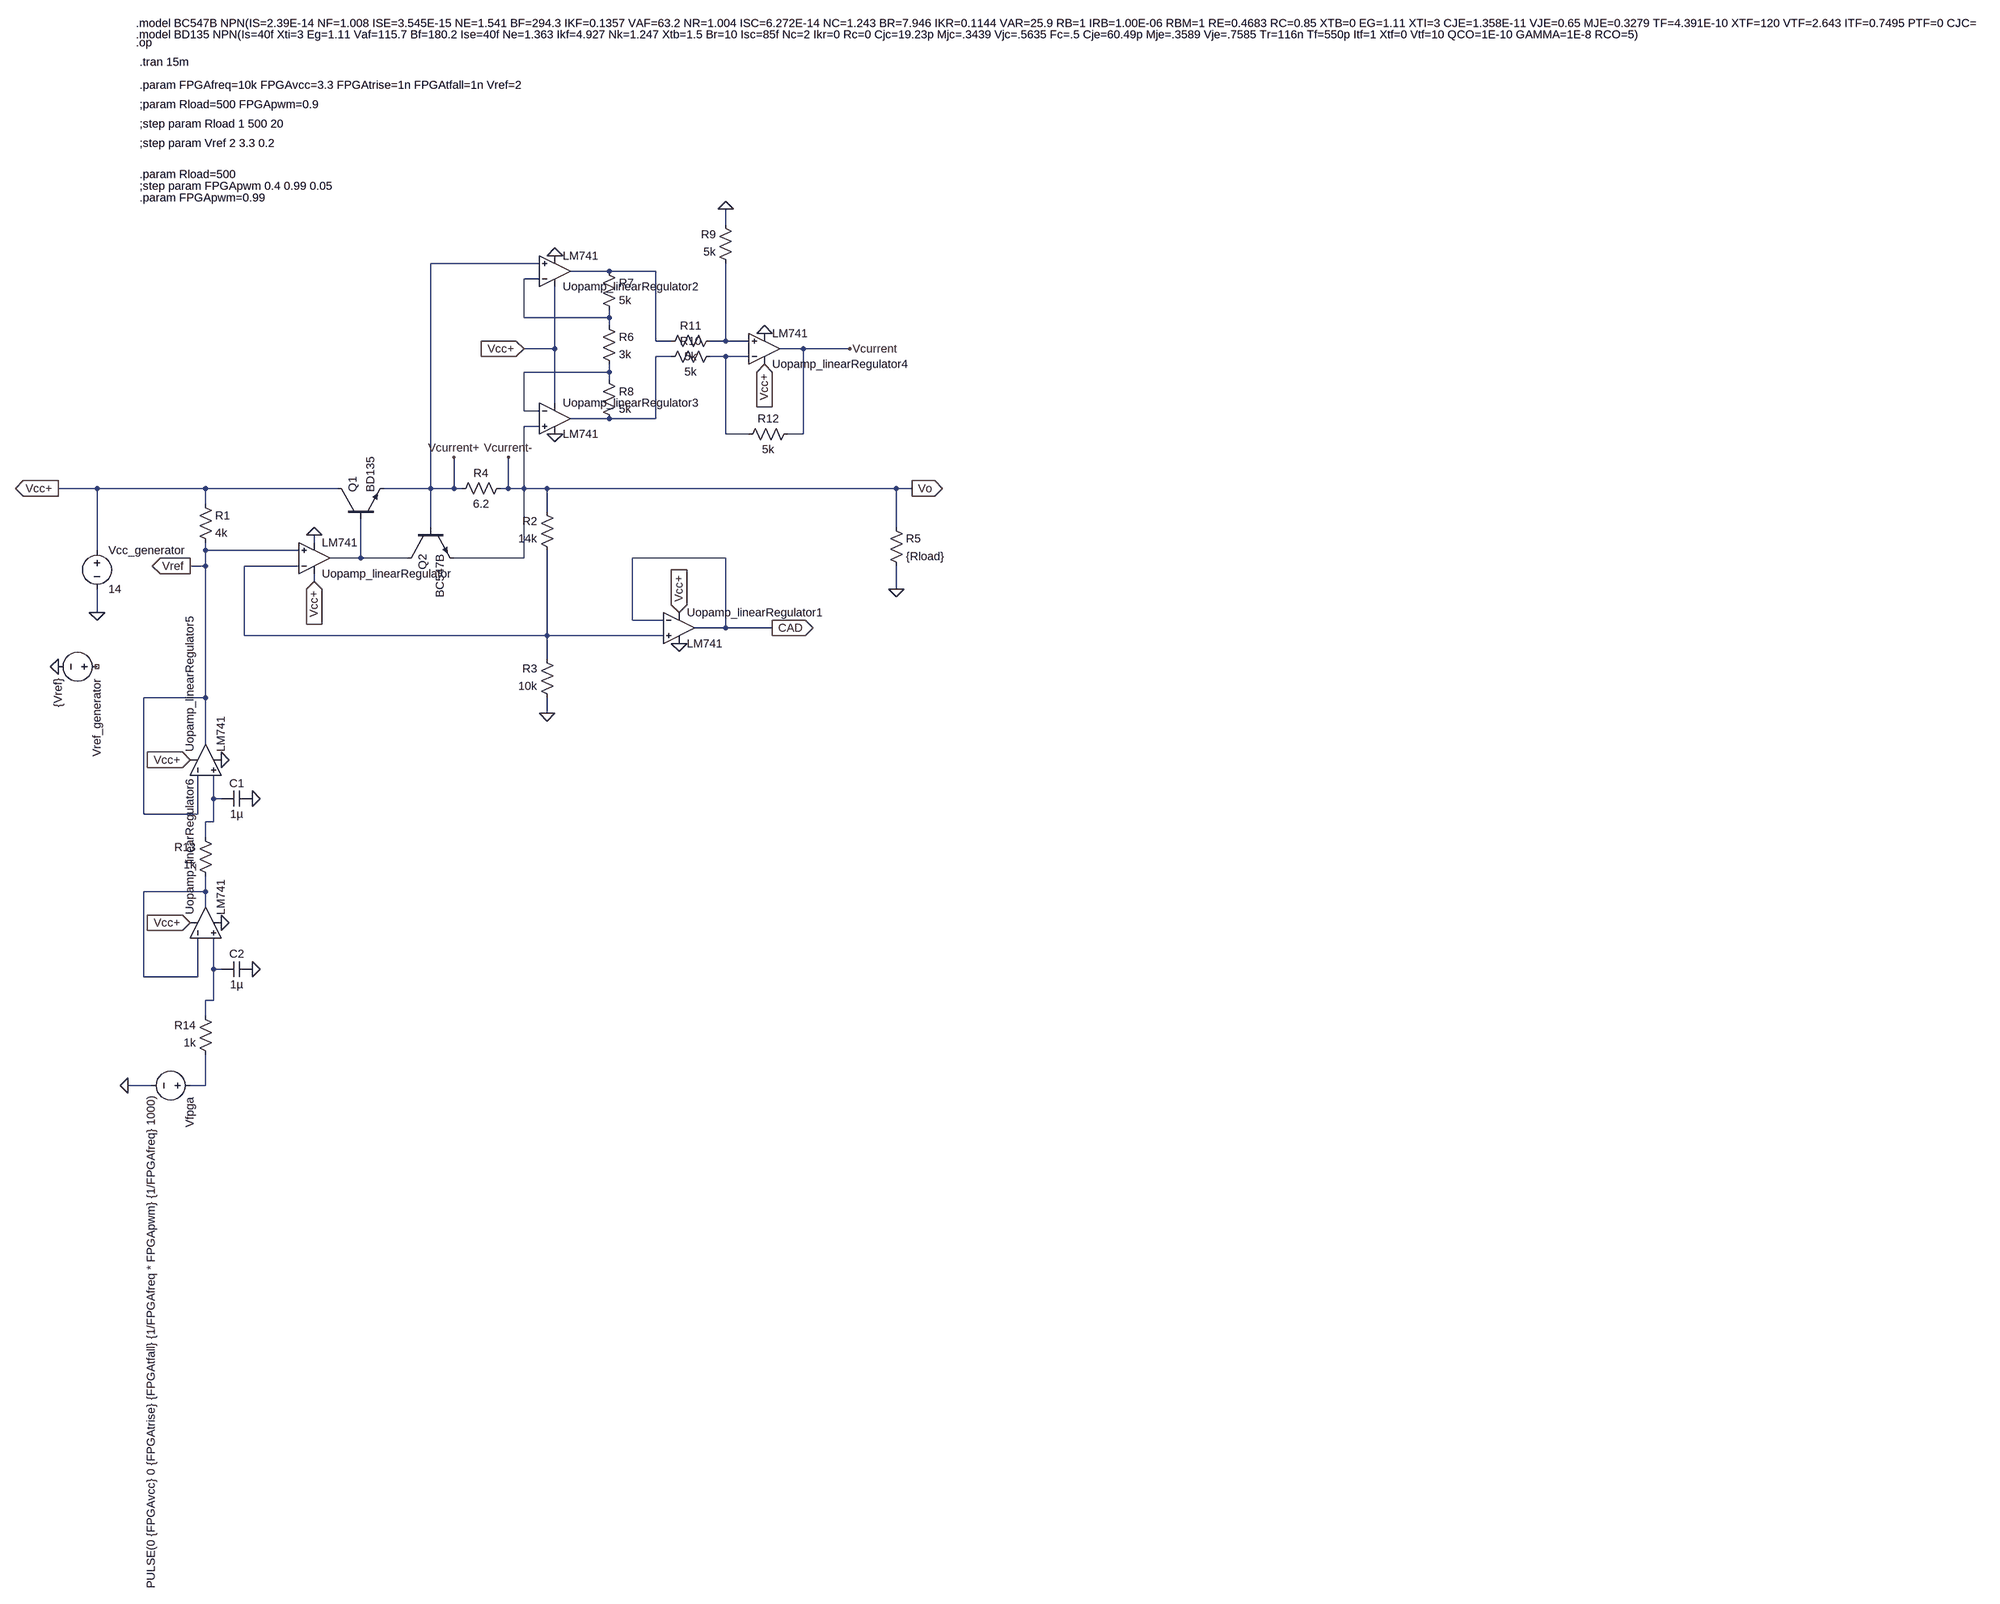
[diagram p0: schematic LinearRegulator.asc]
LinearRegulator.asc, the LTspice schematic file:
Version 4
SHEET 1 5716 2444
WIRE 1200 -544 1200 -576
WIRE 816 -464 592 -464
WIRE 960 -448 880 -448
WIRE 1056 -448 960 -448
WIRE 816 -432 784 -432
WIRE 784 -352 784 -432
WIRE 960 -352 960 -368
WIRE 960 -352 784 -352
WIRE 960 -336 960 -352
WIRE 1056 -304 1056 -448
WIRE 1088 -304 1056 -304
WIRE 1200 -304 1200 -464
WIRE 1200 -304 1168 -304
WIRE 1248 -304 1200 -304
WIRE 848 -288 848 -416
WIRE 848 -288 784 -288
WIRE 1360 -288 1312 -288
WIRE 1456 -288 1360 -288
WIRE 1088 -272 1056 -272
WIRE 1200 -272 1168 -272
WIRE 1248 -272 1200 -272
WIRE 960 -240 960 -256
WIRE 960 -240 784 -240
WIRE 960 -224 960 -240
WIRE 848 -176 848 -288
WIRE 784 -160 784 -240
WIRE 816 -160 784 -160
WIRE 960 -144 880 -144
WIRE 1056 -144 1056 -272
WIRE 1056 -144 960 -144
WIRE 816 -128 784 -128
WIRE 1200 -112 1200 -272
WIRE 1248 -112 1200 -112
WIRE 1360 -112 1360 -288
WIRE 1360 -112 1328 -112
WIRE -96 0 -176 0
WIRE 128 0 -96 0
WIRE 400 0 128 0
WIRE 592 0 592 -464
WIRE 592 0 496 0
WIRE 640 0 640 -64
WIRE 640 0 592 0
WIRE 656 0 640 0
WIRE 752 0 752 -64
WIRE 752 0 736 0
WIRE 784 0 784 -128
WIRE 784 0 752 0
WIRE 832 0 784 0
WIRE 1552 0 832 0
WIRE 1584 0 1552 0
WIRE 128 32 128 0
WIRE 832 48 832 0
WIRE 592 80 592 0
WIRE 1552 80 1552 0
WIRE 352 112 352 96
WIRE -96 128 -96 0
WIRE 128 128 128 112
WIRE 320 128 128 128
WIRE 448 144 448 64
WIRE 448 144 384 144
WIRE 544 144 448 144
WIRE 784 144 784 0
WIRE 784 144 640 144
WIRE 1200 144 1008 144
WIRE 128 160 128 128
WIRE 128 160 96 160
WIRE 320 160 208 160
WIRE 352 192 352 176
WIRE 1552 208 1552 160
WIRE -96 256 -96 208
WIRE 1008 272 1008 144
WIRE 1072 272 1008 272
WIRE 1200 288 1200 144
WIRE 1200 288 1136 288
WIRE 1296 288 1200 288
WIRE 208 304 208 160
WIRE 832 304 832 128
WIRE 832 304 208 304
WIRE 1072 304 832 304
WIRE 832 352 832 304
WIRE 128 432 128 160
WIRE 128 432 0 432
WIRE 832 464 832 432
WIRE 128 528 128 432
WIRE 144 640 144 592
WIRE 160 640 144 640
WIRE 0 672 0 432
WIRE 112 672 112 592
WIRE 112 672 0 672
WIRE 144 688 144 640
WIRE 144 688 128 688
WIRE 128 720 128 688
WIRE 128 832 128 800
WIRE 128 832 0 832
WIRE 128 864 128 832
WIRE 144 992 144 928
WIRE 160 992 144 992
WIRE 0 1008 0 832
WIRE 112 1008 112 928
WIRE 112 1008 0 1008
WIRE 144 1056 144 992
WIRE 144 1056 128 1056
WIRE 128 1088 128 1056
WIRE 16 1232 -32 1232
WIRE 128 1232 128 1168
WIRE 128 1232 96 1232
FLAG -96 256 0
FLAG 832 464 0
FLAG 352 192 Vcc+
IOPIN 352 192 In
FLAG 784 -288 Vcc+
IOPIN 784 -288 In
FLAG 1200 -576 0
FLAG 640 -64 Vcurrent+
FLAG 752 -64 Vcurrent-
FLAG 1456 -288 Vcurrent
FLAG 1104 256 Vcc+
IOPIN 1104 256 In
FLAG 1296 288 CAD
IOPIN 1296 288 Out
FLAG -176 0 Vcc+
IOPIN -176 0 Out
FLAG 352 96 0
FLAG 1104 320 0
FLAG 848 -112 0
FLAG 848 -480 0
FLAG 1280 -256 Vcc+
IOPIN 1280 -256 In
FLAG 1280 -320 0
FLAG -176 368 0
FLAG 1552 208 0
FLAG 96 160 Vref
IOPIN 96 160 Out
FLAG 1584 0 Vo
IOPIN 1584 0 Out
FLAG -32 1232 0
FLAG 96 896 Vcc+
IOPIN 96 896 In
FLAG 160 896 0
FLAG 160 560 0
FLAG 96 560 Vcc+
IOPIN 96 560 In
FLAG 224 640 0
FLAG 224 992 0
SYMBOL voltage -96 112 R0
WINDOW 123 0 0 Left 0
WINDOW 39 0 0 Left 0
SYMATTR InstName Vcc_generator
SYMATTR Value 14
SYMBOL res 112 16 R0
SYMATTR InstName R1
SYMATTR Value 4k
SYMBOL npn 400 64 R270
SYMATTR InstName Q1
SYMATTR Value BD135
SYMBOL npn 544 80 M90
SYMATTR InstName Q2
SYMATTR Value BC547B
SYMBOL res 848 144 R180
WINDOW 0 36 76 Left 2
WINDOW 3 36 40 Left 2
SYMATTR InstName R2
SYMATTR Value 14k
SYMBOL res 848 448 R180
WINDOW 0 36 76 Left 2
WINDOW 3 36 40 Left 2
SYMATTR InstName R3
SYMATTR Value 10k
SYMBOL res 640 16 R270
WINDOW 0 32 56 VTop 2
WINDOW 3 0 56 VBottom 2
SYMATTR InstName R4
SYMATTR Value 6.2
SYMBOL res 1536 64 R0
SYMATTR InstName R5
SYMATTR Value {Rload}
SYMBOL LM741 352 208 M180
SYMATTR InstName Uopamp_linearRegulator
SYMBOL res 944 -352 R0
SYMATTR InstName R6
SYMATTR Value 3k
SYMBOL res 944 -464 R0
SYMATTR InstName R7
SYMATTR Value 5k
SYMBOL res 944 -240 R0
SYMATTR InstName R8
SYMATTR Value 5k
SYMBOL res 1216 -448 R180
WINDOW 0 36 76 Left 2
WINDOW 3 36 40 Left 2
SYMATTR InstName R9
SYMATTR Value 5k
SYMBOL res 1184 -288 R90
WINDOW 0 0 56 VBottom 2
WINDOW 3 32 56 VTop 2
SYMATTR InstName R10
SYMATTR Value 5k
SYMBOL res 1184 -320 R90
WINDOW 0 0 56 VBottom 2
WINDOW 3 32 56 VTop 2
SYMATTR InstName R11
SYMATTR Value 5k
SYMBOL res 1344 -128 R90
WINDOW 0 0 56 VBottom 2
WINDOW 3 32 56 VTop 2
SYMATTR InstName R12
SYMATTR Value 5k
SYMBOL voltage -80 368 R90
WINDOW 123 0 0 Left 0
WINDOW 39 0 0 Left 0
SYMATTR InstName Vref_generator
SYMATTR Value {Vref}
SYMBOL voltage 112 1232 R90
WINDOW 123 0 0 Left 0
WINDOW 39 0 0 Left 0
SYMATTR InstName Vfpga
SYMATTR Value PULSE(0 {FPGAvcc} 0 {FPGAtrise} {FPGAtfall} {1/FPGAfreq * FPGApwm} {1/FPGAfreq} 1000)
SYMBOL res 144 816 R180
WINDOW 0 36 76 Left 2
WINDOW 3 36 40 Left 2
SYMATTR InstName R13
SYMATTR Value 1k
SYMBOL cap 224 624 R90
WINDOW 0 0 32 VBottom 2
WINDOW 3 32 32 VTop 2
SYMATTR InstName C1
SYMATTR Value 1µ
SYMBOL cap 224 976 R90
WINDOW 0 0 32 VBottom 2
WINDOW 3 32 32 VTop 2
SYMATTR InstName C2
SYMATTR Value 1µ
SYMBOL res 144 1184 R180
WINDOW 0 36 76 Left 2
WINDOW 3 36 40 Left 2
SYMATTR InstName R14
SYMATTR Value 1k
SYMBOL LM741 1104 224 R0
SYMATTR InstName Uopamp_linearRegulator1
SYMBOL LM741 848 -384 M180
SYMATTR InstName Uopamp_linearRegulator2
SYMBOL LM741 848 -208 R0
SYMATTR InstName Uopamp_linearRegulator3
SYMBOL LM741 1280 -224 M180
SYMATTR InstName Uopamp_linearRegulator4
SYMBOL LM741 64 560 R270
SYMATTR InstName Uopamp_linearRegulator5
SYMBOL LM741 64 896 R270
SYMATTR InstName Uopamp_linearRegulator6
TEXT -8 -880 Left 2 !.tran 15m
TEXT -8 -752 Left 2 !;step param Rload 1 500 20
TEXT -16 -920 Left 2 !.op
TEXT -16 -936 Left 2 !.model BD135 NPN(Is=40f Xti=3 Eg=1.11 Vaf=115.7 Bf=180.2 Ise=40f Ne=1.363 Ikf=4.927 Nk=1.247 Xtb=1.5 Br=10 Isc=85f Nc=2 Ikr=0 Rc=0 Cjc=19.23p Mjc=.3439 Vjc=.5635 Fc=.5 Cje=60.49p Mje=.3589 Vje=.7585 Tr=116n Tf=550p Itf=1 Xtf=0 Vtf=10 QCO=1E-10 GAMMA=1E-8 RCO=5)
TEXT -8 -792 Left 2 !;param Rload=500 FPGApwm=0.9
TEXT -16 -960 Left 2 !.model BC547B NPN(IS=2.39E-14 NF=1.008 ISE=3.545E-15 NE=1.541 BF=294.3 IKF=0.1357 VAF=63.2 NR=1.004 ISC=6.272E-14 NC=1.243 BR=7.946 IKR=0.1144 VAR=25.9 RB=1 IRB=1.00E-06 RBM=1 RE=0.4683 RC=0.85 XTB=0 EG=1.11 XTI=3 CJE=1.358E-11 VJE=0.65 MJE=0.3279 TF=4.391E-10 XTF=120 VTF=2.643 ITF=0.7495 PTF=0 CJC=3.728E-12 VJC=0.3997 MJC=0.2955 XCJC=0.6193 TR=1.00E-32 CJS=0 VJS=0.75 MJS=0.333 FC=0.9579 Vceo=45 Icrating=100m mfg=Philips)
TEXT -8 -712 Left 2 !;step param Vref 2 3.3 0.2
TEXT -8 -832 Left 2 !.param FPGAfreq=10k FPGAvcc=3.3 FPGAtrise=1n FPGAtfall=1n Vref=2
TEXT -8 -648 Left 2 !.param Rload=500
TEXT -8 -624 Left 2 !;step param FPGApwm 0.4 0.99 0.05
TEXT -8 -600 Left 2 !.param FPGApwm=0.99

The netlist it stands for:
* LinearRegulator.asc
Vcc_generator Vcc+ 0 14
R1 Vcc+ Vref 4k
Q1 Vcc+ N007 Vcurrent+ 0 BD135
Q2 N007 Vcurrent+ Vo 0 BC547B
R2 N008 Vo 14k
R3 0 N008 10k
R4 Vcurrent+ Vo 6.2
R5 Vo 0 {Rload}
XUopamp_linearRegulator Vref N008 Vcc+ 0 N007 LM741  ; pins In+ In- V+ V- OUT
R6 N002 N006 3k
R7 N001 N002 5k
R8 N006 N004 5k
R9 N003 0 5k
R10 N005 N004 5k
R11 N003 N001 5k
R12 Vcurrent N005 5k
Vref_generator NC_01 0 {Vref}
Vfpga N012 0 PULSE(0 {FPGAvcc} 0 {FPGAtrise} {FPGAtfall} {1/FPGAfreq * FPGApwm} {1/FPGAfreq} 1000)
R13 N010 N009 1k
C1 0 N009 1µ
C2 0 N011 1µ
R14 N012 N011 1k
XUopamp_linearRegulator1 N008 CAD Vcc+ 0 CAD LM741  ; pins In+ In- V+ V- OUT
XUopamp_linearRegulator2 Vcurrent+ N002 Vcc+ 0 N001 LM741  ; pins In+ In- V+ V- OUT
XUopamp_linearRegulator3 Vo N006 Vcc+ 0 N004 LM741  ; pins In+ In- V+ V- OUT
XUopamp_linearRegulator4 N003 N005 Vcc+ 0 Vcurrent LM741  ; pins In+ In- V+ V- OUT
XUopamp_linearRegulator5 N009 Vref Vcc+ 0 Vref LM741  ; pins In+ In- V+ V- OUT
XUopamp_linearRegulator6 N011 N010 Vcc+ 0 N010 LM741  ; pins In+ In- V+ V- OUT
.model NPN NPN
.model PNP PNP
.lib standard.bjt
.tran 15m
;step param Rload 1 500 20
.op
.model BD135 NPN(Is=40f Xti=3 Eg=1.11 Vaf=115.7 Bf=180.2 Ise=40f Ne=1.363 Ikf=4.927 Nk=1.247 Xtb=1.5 Br=10 Isc=85f Nc=2 Ikr=0 Rc=0 Cjc=19.23p Mjc=.3439 Vjc=.5635 Fc=.5 Cje=60.49p Mje=.3589 Vje=.7585 Tr=116n Tf=550p Itf=1 Xtf=0 Vtf=10 QCO=1E-10 GAMMA=1E-8 RCO=5)
;param Rload=500 FPGApwm=0.9
.model BC547B NPN(IS=2.39E-14 NF=1.008 ISE=3.545E-15 NE=1.541 BF=294.3 IKF=0.1357 VAF=63.2 NR=1.004 ISC=6.272E-14 NC=1.243 BR=7.946 IKR=0.1144 VAR=25.9 RB=1 IRB=1.00E-06 RBM=1 RE=0.4683 RC=0.85 XTB=0 EG=1.11 XTI=3 CJE=1.358E-11 VJE=0.65 MJE=0.3279 TF=4.391E-10 XTF=120 VTF=2.643 ITF=0.7495 PTF=0 CJC=3.728E-12 VJC=0.3997 MJC=0.2955 XCJC=0.6193 TR=1.00E-32 CJS=0 VJS=0.75 MJS=0.333 FC=0.9579 Vceo=45 Icrating=100m mfg=Philips)
;step param Vref 2 3.3 0.2
.param FPGAfreq=10k FPGAvcc=3.3 FPGAtrise=1n FPGAtfall=1n Vref=2
.param Rload=500
;step param FPGApwm 0.4 0.99 0.05
.param FPGApwm=0.99
.lib LM741.lib
.backanno
.end